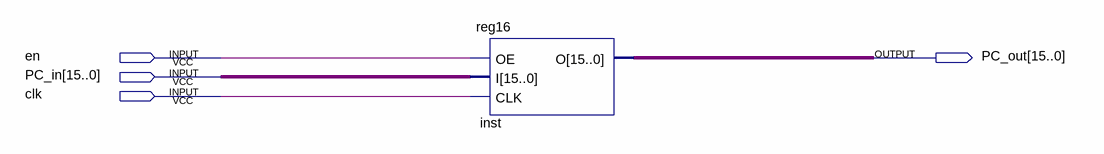
[diagram p0: schematic sheet]
// Quartus schematic PC.bdf as structural Verilog: 1 symbols, 4 pins
module PC (
  input  en,
  input  [15:0] PC_in,
  input  clk,
  output [15:0] PC_out
);

  reg16 inst (.OE(en), .I(PC_in), .CLK(clk), .O(PC_out));
endmodule
